# Altium schematic sheet LCD_board.SchDoc
size A4; SheetNumber: 7; SheetTotal: 7
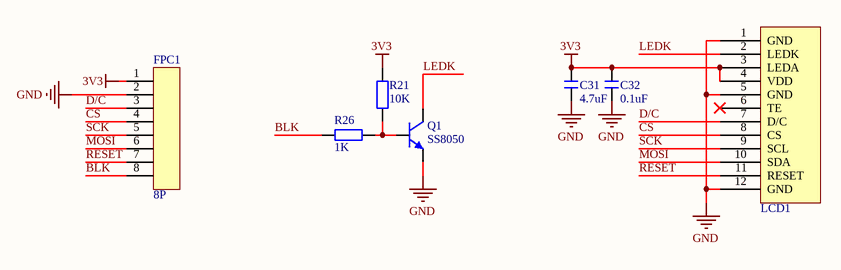
[diagram p0: LCD_board.SchDoc]

## Parts
C31  4.7uF  [C 0603_L]
C32  0.1uF  [C 0603_L]
FPC1  8P  [FPC0.5 2H-WS-8P]
LCD1  0.99‘IPS LCD显示屏  [LCD-SMD_0.99’IPS-LCD]  (value not drawn)
Q1  SS8050  [SOT23-3N]
R21  10K  [R 0603_L]
R26  1K  [R 0603_L]

## Nets
3V3: C31.2 C32.2 FPC1.1 LCD1.3(LEDA) LCD1.4(VDD) R21.2
GND: C31.1 C32.1 FPC1.2 LCD1.1(GND) LCD1.5(GND) LCD1.12(GND) Q1.2(E)
BLK: FPC1.8 R26.1
CS: FPC1.4 LCD1.8(CS)
D/C: FPC1.3 LCD1.7(D/C)
LEDK: LCD1.2(LEDK) Q1.3(C)
MOSI: FPC1.6 LCD1.10(SDA)
RESET: FPC1.7 LCD1.11(RESET)
SCK: FPC1.5 LCD1.9(SCL)
NetQ1_1: Q1.1(B) R21.1 R26.2

Not connected (* = marked no-connect by the designer): LCD1 6(TE)*

## Library data of the parts
C31 C32 = C: 贴片电容; BOM名称: 无极性贴片电容; 淘宝ID: 封装库来自淘宝 ID：黄晶宝石; 联系售后: https://shop463601444.taobao.com
LCD1 = 0.99‘IPS LCD显示屏: 128*115RGB 12P焊接圆屏
Q1 = 8050-SMD: 高频放大-NPN型; 版权归属: 封装库来自淘宝 ID：黄晶宝石; 属性: 40V 1.5A 1W 100MHZ; BOM名称: 高频放大-NPN型; 联系售后: https://shop463601444.taobao.com
R21 R26 = R: 贴片电阻; 版权归属: 来自淘宝 ID：黄晶宝石; BOM名称: 贴片电阻; 联系售后: https://shop463601444.taobao.com